# Altium project SoM.PrjPcb (part 3 of 4)

## Sheet [15] PushButtons.SchDoc
size B; Organization: Altium Limited; Address1: L3, 12a Rodborough Rd; Address2: Frenchs Forest; Address3: NSW; Address4: Australia 2086
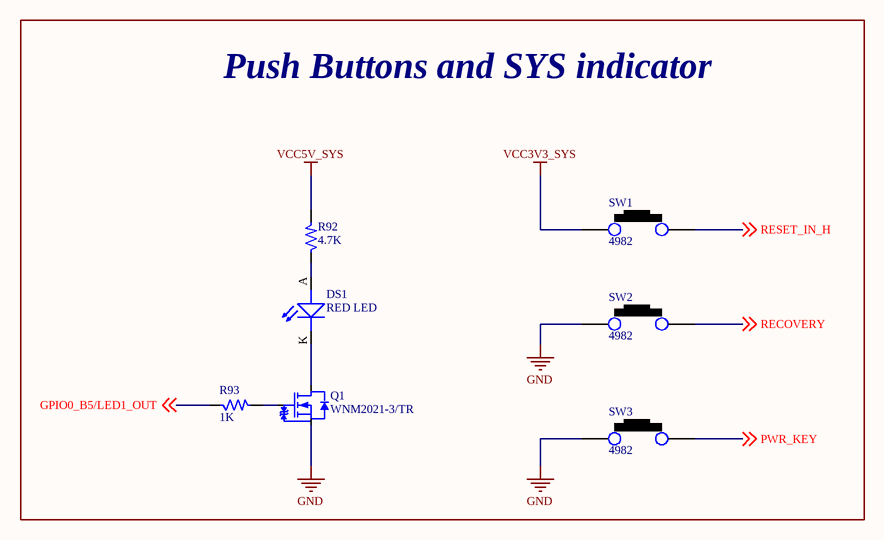
[diagram p14: [15] PushButtons.SchDoc]

### Parts
DS1  RED LED  [LED_0805]
Q1  WNM2021-3/TR  [SOT-323-3]
R92  4.7K  [RES_0201]
R93  1K  [RES_0201]
SW1  4982  [SW_177_39.3X77.7_SMD]
SW2  4982  [SW_177_39.3X77.7_SMD]
SW3  4982  [SW_177_39.3X77.7_SMD]

### Blocks framed on the sheet
Push Buttons and SYS indicator: DS1 Q1 R92 R93 SW1-SW3

### Nets
GND: Q1.2(S) SW2.1 SW3.1
VCC3V3_SYS: SW1.1  [project net VCC7]
VCC5V_SYS: R92.2
GPIO0_B5/LED1_OUT: R93.1 ; off-sheet GPIO0_B5/LED1_OUT
PWR_KEY: SW3.2 ; off-sheet PWR_KEY
RECOVERY: SW2.2 ; off-sheet RECOVERY
RESET_IN_H: SW1.2 ; off-sheet RESET_IN_H
NetDS1_A: DS1.A(ANODE) R92.1
NetDS1_K: DS1.K(CATHODE) Q1.3(D)
NetQ1_1: Q1.1(G) R93.2

### Notes on the sheet
- Title
- Size:
- Date:
- B
- Number:
- Time:
- Revision:
- Sheet
- of
- File:

### Library data of the parts
DS1 = LED_RED-2V-20mA-0805: Red 631nm LED Indication - Discrete 2V 0805 (2012 Metric); Manufacturer: Vishay Lite-On; Manufacturer Part Number: LTST-C171KRKT; Case/Package: 0805; Supplier-1: SP ROAD
Q1 = MOSFET-N_20V-820mA-SOT-323: N Channel 20V 820mA 850mV @ 250uA 310mΩ @ 550mA,4.5V 310mW SOT-323(SC-70) MOSFET RoHS /; Manufacturer: WILLSEMI(Will Semicon); Manufacturer Part Number: WNM2021-3/TR; Case/Package: SOT-323(SC-70); Supplier-1: LCSC
R92 = RES_4.7K-0.1W-1%-0201: 4.02 kOhms ±1% 0.05W, 1/20W Chip Resistor 0201 (0603 Metric) Thick Film /; Manufacturer: Yageo; Manufacturer Part Number: RC0201FR-074K02L; Case/Package: 0201; Supplier-1: Digikey
R93 = RES_1K-0.05W-1%-0201: 1 kOhms ±1% 0.05W, 1/20W Chip Resistor 0201 (0603 Metric) Thick Film /; Manufacturer: Yageo; Manufacturer Part Number: RC0201FR-071KL; Case/Package: 0201; Supplier-1: Digikey
SW1-SW3 = SW1_4982: Tactile Switch 3x4x2mm SMD 2-Pin; Manufacturer: NA; Manufacturer Part Number: NA; Case/Package: SMD; Supplier-1: Sunrom

## Sheet [16] SPI_TYPEC_PWR.SchDoc
size B; Organization: Altium Limited; Address1: L3, 12a Rodborough Rd; Address2: Frenchs Forest; Address3: NSW; Address4: Australia 2086
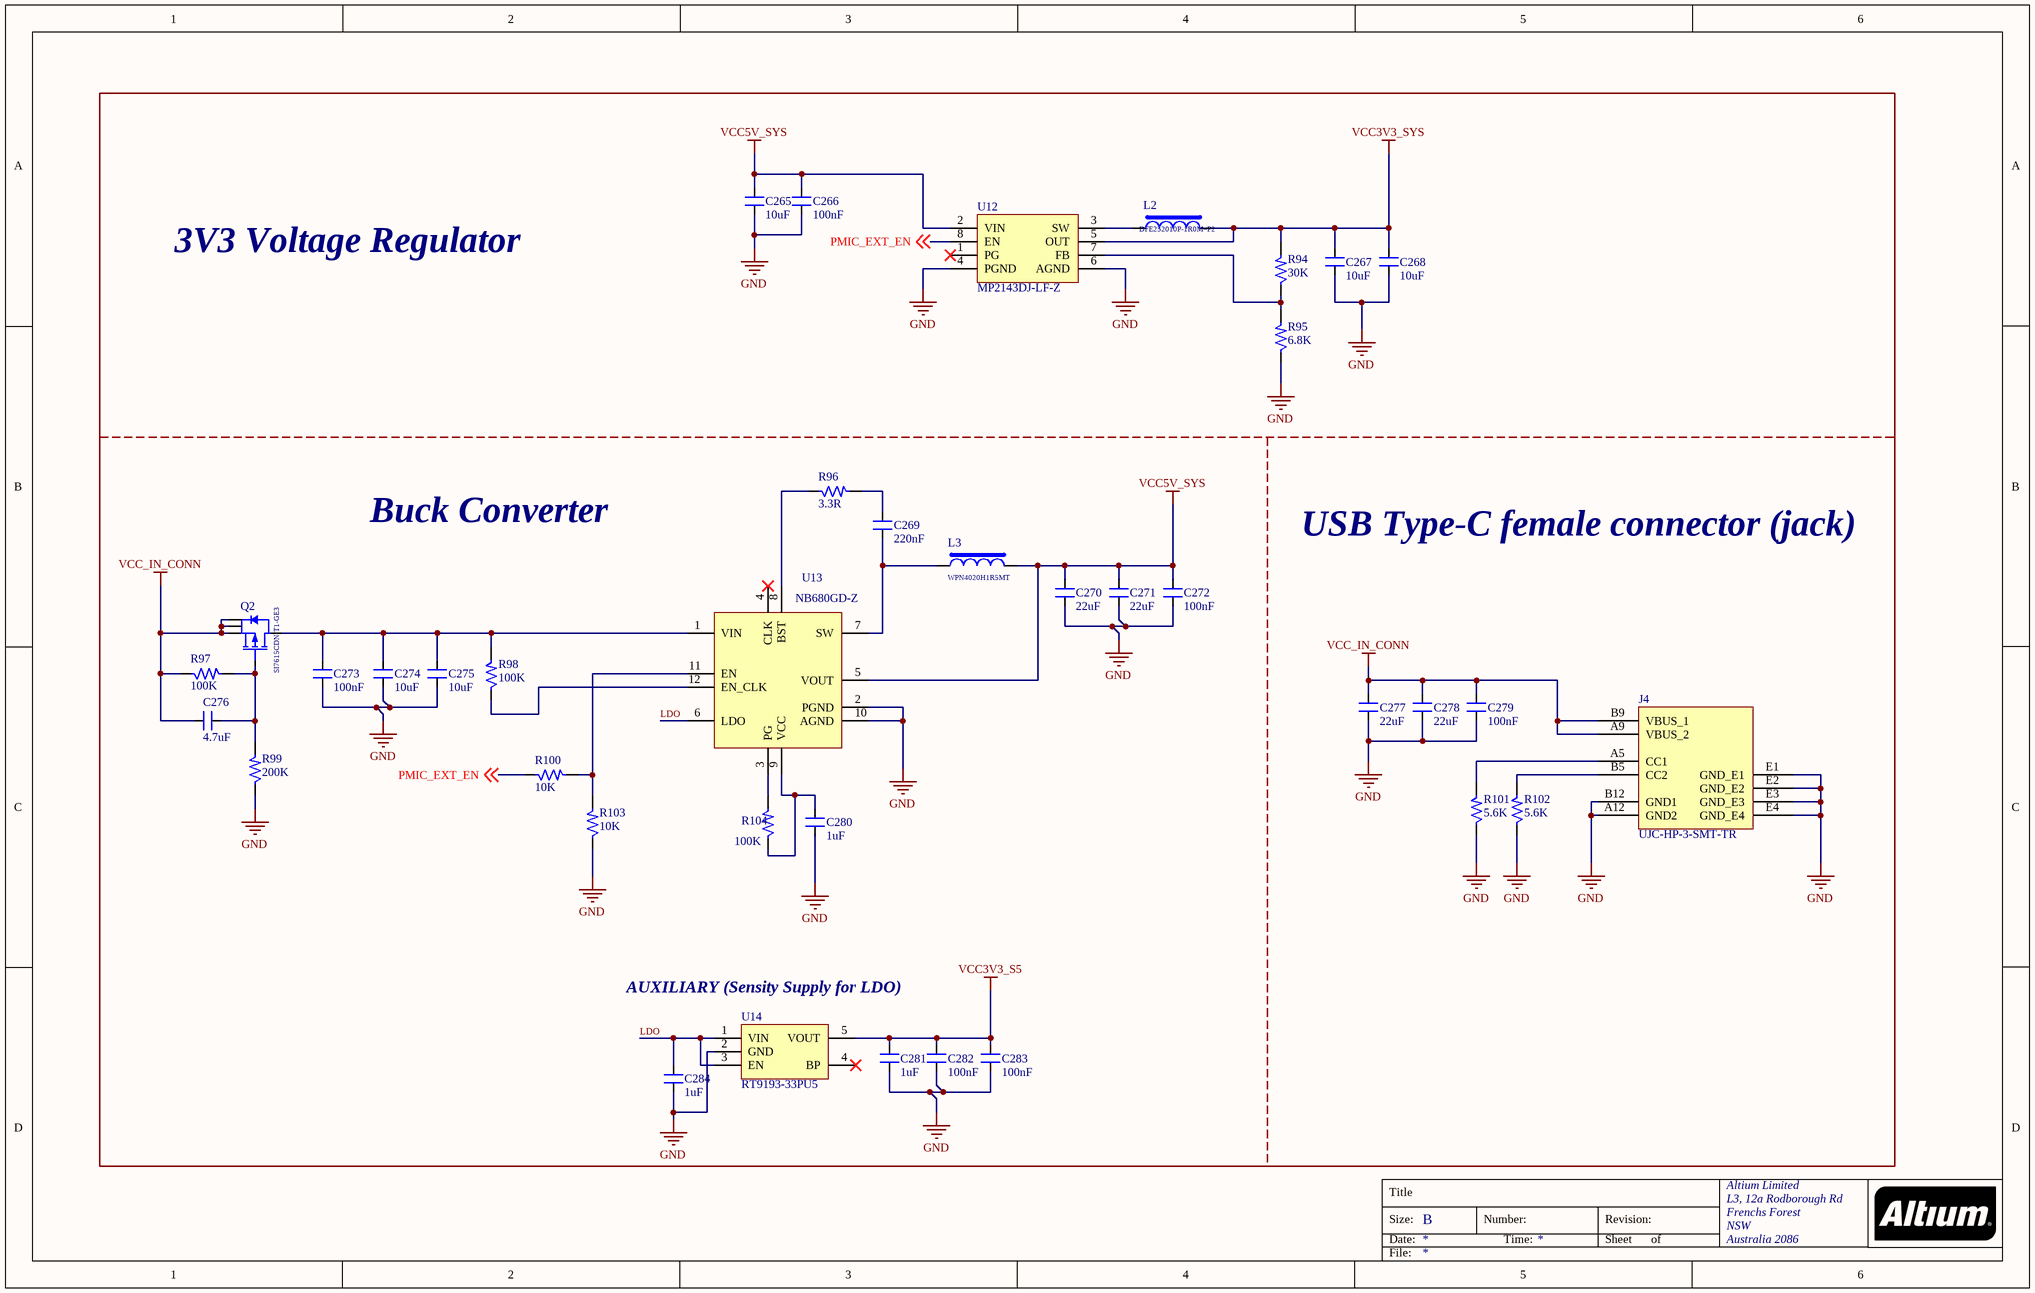
[diagram p15: [16] SPI_TYPEC_PWR.SchDoc]

### Parts
C265  10uF  [CAP_0402]
C266  100nF  [CAP_0402]
C267  10uF  [CAP_0402]
C268  10uF  [CAP_0402]
C269  220nF  [CAP_0402]
C270  22uF  [CAP_0402]
C271  22uF  [CAP_0402]
C272  100nF  [CAP_0402]
C273  100nF  [CAP_0402]
C274  10uF  [CAP_0402]
C275  10uF  [CAP_0402]
C276  4.7uF  [CAP_0402]
C277  22uF  [CAP_0402]
C278  22uF  [CAP_0402]
C279  100nF  [CAP_0201]
C280  1uF  [CAP_0402]
C281  1uF  [CAP_0402]
C282  100nF  [CAP_0402]
C283  100nF  [CAP_0402]
C284  1uF  [CAP_0402]
J4  UJC-HP-3-SMT-TR  [CON6_48.4_UJC-HP-3-SMT-TR]
L2  DFE252010P-1R0M=P2  [IND_1008]
L3  WPN4020H1R5MT  [IND_1616]
Q2  SI7615CDN-T1-GE3  [PowerPAK_1212-8_SMD]
R94  30K  [RES_0402]
R95  6.8K  [RES_0402]
R96  3.3R  [RES_0402]
R97  100K  [RES_0402]
R98  100K  [RES_0402]
R99  200K  [RES_0402]
R100  10K  [RES_0402]
R101  5.6K  [RES_0201]
R102  5.6K  [RES_0201]
R103  10K  [RES_0402]
R104  100K  [RES_0402]
U12  MP2143DJ-LF-Z  [SOT23-8]
U13  NB680GD-Z  [QFN-12_19_118X118_SMD]
U14  RT9193-33PU5  [SC70-5]

### Nets
GND: C265.1 C266.1 C267.1 C268.1 C270.1 C271.1 C272.1 C273.1 C274.1 C275.1 C277.1 C278.1 C279.1 C280.1 C281.1 C282.1 C283.1 C284.1 J4.A12(GND2) J4.B12(GND1) J4.E1(GND_E1) J4.E2(GND_E2) J4.E3(GND_E3) J4.E4(GND_E4) R95.1 R99.1 R101.1 R102.1 R103.1 U12.4(PGND) U12.6(AGND) U13.2(PGND) U13.10(AGND) U14.2(GND)
VCC3V3_S5: C281.2 C282.2 C283.2 U14.5(VOUT)
VCC3V3_SYS: C267.2 C268.2 L2.2 R94.2 U12.5(OUT)  [project net VCC7]
VCC5V_SYS: C265.2 C266.2 C270.2 C271.2 C272.2 L3.2 U12.2(VIN) U13.5(VOUT)
VCC_IN_CONN: C276.1 C277.2 C278.2 C279.2 J4.A9(VBUS_2) J4.B9(VBUS_1) Q2.1(S) Q2.2(S) Q2.3(S) R97.1
LDO: C284.2 U13.6(LDO) U14.1(VIN) U14.3(EN)
PMIC_EXT_EN: R100.1 U12.8(EN) ; off-sheet PMIC_EXT_EN
NetC269_1: C269.1 L3.1 U13.7(SW)
NetC269_2: C269.2 R96.2
NetC273_2: C273.2 C274.2 C275.2 Q2.5(D) R98.2 U13.1(VIN)
NetC276_2: C276.2 Q2.4(G) R97.2 R99.2
NetC280_2: C280.2 R104.1 U13.9(VCC)
NetJ4_A5: J4.A5(CC1) R101.2
NetJ4_B5: J4.B5(CC2) R102.2
NetL2_1: L2.1 U12.3(SW)
NetR94_1: R94.1 R95.2 U12.7(FB)
NetR96_1: R96.1 U13.8(BST)
NetR98_1: R98.1 U13.12(EN_CLK)
NetR100_2: R100.2 R103.2 U13.11(EN)
NetR104_2: R104.2 U13.3(PG)

Not connected (* = marked no-connect by the designer): U12 1(PG)*; U13 4(CLK)*; U14 4(BP)*

### Notes on the sheet
- 3V3 Voltage Regulator
- Buck Converter
- USB Type-C female connector (jack)
- AUXILIARY (Sensity Supply for LDO)
- Title
- Size:
- Date:
- B
- Number:
- Time:
- Revision:
- Sheet
- of
- File:

### Library data of the parts
C265 C267 C268 C274 C275 = CAP_10uF-10V-20%-0402: as C243 on sheet [13] TYPEC0_PROG; Case/Package: 0402; Supplier-1: Digikey
C266 = CAP_100nF-10V-10%-0402: 0.1µF ±10% 10V Ceramic Capacitor X7R 0402 (1005 Metric) /; Manufacturer: Yageo; Manufacturer Part Number: CC0402KRX7R6BB104; Case/Package: 0402; Supplier-1: Digikey
C269 = CAP_220nF-10V-10%-0402: 0.22µF ±10% 10V Ceramic Capacitor X7R 0402 (1005 Metric) /; Manufacturer: Samsung Electro-Mechanics; Manufacturer Part Number: CL05B224KP5NNNC; Case/Package: 0402; Supplier-1: Digikey
C270 C271 C277 C278 = CAP_22uF-6.3V-20%-0402: 22µF ±20% 6.3V Ceramic Capacitor X5R 0402 (1005 Metric) /; Manufacturer: Murata Electronics; Manufacturer Part Number: CL05A226MQ5N6J8; Case/Package: 0402; Supplier-1: Digikey
C272 C273 C282 C283 = CAP_100nF-25V-10%-0402: as C231 on sheet [13] TYPEC0_PROG; Case/Package: 0402; Supplier-1: Digikey
C276 = CAP_4.7uF-10V-10%-0402: 4.7µF ±10% 10V Ceramic Capacitor X5R 0402 (1005 Metric) /; Manufacturer: Samsung Electro-Mechanics; Manufacturer Part Number: CL05A475KP5NRNC; Case/Package: 0402; Supplier-1: Digikey
C279 = CAP_100nF-25V-10%-0201: as C187-C190 on sheet [4] RK3399_EMMC_ADC_PCIE; Case/Package: 0201; Supplier-1: Digikey
C280 = CAP_1uF-16V-10%-0402: as C252 on sheet [14] Ethernet; Case/Package: 0402; Supplier-1: Digikey
C281 C284 = CAP_1uF-10V-10%-0402: as C232-C234 on sheet [13] TYPEC0_PROG; Case/Package: 0402; Supplier-1: Digikey
J4 = CON-TYPEC_6X1-100-RA-TH: USB Connectors USB jack, C type, power only, 6 pin, horizonal, gold flash plating, surface mount, T&R; Manufacturer: CUI Devices; Manufacturer Part Number: UJC-HP-3-SMT-TR; Case/Package: TH; Supplier-1: Mouser
L2 = IND_1uH-3.8A-20%-1008: 1µH Shielded Wirewound Inductor 3.8A 54mOhm Max 1008 (2520 Metric) /; Manufacturer: Murata Electronics; Manufacturer Part Number: DFE252010P-1R0M=P2; Case/Package: 1008; Supplier-1: Digikey
L3 = IND_1.5uH-6A-20%-SMD: Wire Wound SMD Power Inductors – WPN Series / Operating Temp. : -40℃~+125℃ (Including self-heating) /; Manufacturer: Sunlord; Mnaufcaturer Part Number: WPN4020H1R5MT; Case/Package: SMD; Supplier-1: NA
Q2 = MOSFET-P_20V-35A-1212-8: P-Channel 20V 35A (Tc) 33W (Tc) Surface Mount PowerPAK® 1212-8 /; Manufacturer: Vishay Siliconix; Manufacturer Part Number: SI7615CDN-T1-GE3; Case/Package: PowerPAK® 1212-8; Supplier-1: Digikey
R94 = RES_30K-0.1W-1%-0402: 30 kOhms ±1% 0.1W, 1/10W Chip Resistor 0402 (1005 Metric) Automotive AEC-Q200, Moisture Resistant Thick Film /; Manufacturer: KOA Speer Electronics, Inc.; Manufacturer Part Number: RK73H1ETTP3002F; Case/Package: 0402; Supplier-1: Digikey
R95 = RES_6.8K-0.1W-1%-0402: 6.8 kOhms ±1% 0.1W, 1/10W Chip Resistor 0402 (1005 Metric) Anti-Sulfur Thin Film /; Manufacturer: Vishay Beyschlag/Draloric/BC Components; Manufacturer Part Number: MCS04020C6801FE000; Supplier-1: Digikey; Case/Package: 0402
R96 = RES_3.3R-0.1W-1%-0402: 3.3 Ohms ±1% 0.1W, 1/10W Chip Resistor 0402 (1005 Metric) Anti-Sulfur, Automotive AEC-Q200 Thick Film /; Manufacturer: Panasonic Electronic Components; Manufacturer Part Number: ERJ-U02F3R30X; Case/Package: 0402; Supplier-1: Digikey
R97 R98 R104 = RES_100K-0.1W-1%-0402: 100 kOhms ±1% 0.1W, 1/10W Chip Resistor 0402 (1005 Metric) Anti-Sulfur Thin Film /; Manufacturer: Vishay Beyschlag/Draloric/BC Components; Manufacturer Part Number: MCS04020C1003FE000; Case/Package: 0402; Supplier-1: Digikey
R99 = RES_200K-0.1W-1%-0402: 200 kOhms ±1% 0.1W, 1/10W Chip Resistor 0402 (1005 Metric) Automotive AEC-Q200 Thick Film /; Manufacturer: Panasonic Electronic Components; Manufacturer Part number: ERJ-2RKF2003X; Case/Package: 0402; Supplier-1: Digikey
R100 R103 = RES_10K-0.1W-1%-0402: 10 kOhms ±1% 0.1W, 1/10W Chip Resistor 0402 (1005 Metric) Anti-Sulfur Thin Film /; Manufacturer: Vishay Beyschlag/Draloric/BC Components; Manufacturer Part Number: MCS04020C1002FE000; Case/Package: 0402; Supplier-1: Digikey
R101 R102 = RES_5.6K-0.05W-1%-0201: 5.6 kOhms ±1% 0.05W, 1/20W Chip Resistor 0201 (0603 Metric) Automotive AEC-Q200 Thick Film /; Manufacturer: Panasonic Electronic Components; Manufacturer Part Number: ERJ-1GNF5601C; Case/Package: 0201; Supplier-1: Digikey
U12 = REG_0.6~5V-5.5V-3A-TSOT-23-8: Switching Voltage Regulators 3A, 5.5V, 1.2MHz Sync Stp-Dwn Swtchr; Manufacturer: Monolithic Power Systems (MPS); Manufacturer Part Number: MP2143DJ-LF-Z; Case/Package: TSOT-23-8; Supplier-1: Mouser
U13 = REG_3.3V-26V-8A-QFN-12: Switching Voltage Regulators 26V Fixed 3.3 V-8A Sync Buck Converter; Manufacturer: Monolithic Power Systems (MPS); Manufacturer Part Number: NB680GD-Z; Case/Package: QFN-12; Supplier-1: Mouser
U14 = REG_3.3V-5.5V-300mA-SC-70-5: SC-70-5 Dropout Regulators(LDO) RoHS; Manufacturer: Richtek Tech; Manufacturer Part Number: RT9193-33PU5; Case/Package: SC-70-5; Supplier-1: LCSC

## Sheet [17] Voltage_Regulators.SchDoc
size B; Organization: Altium Limited; Address1: L3, 12a Rodborough Rd; Address2: Frenchs Forest; Address3: NSW; Address4: Australia 2086
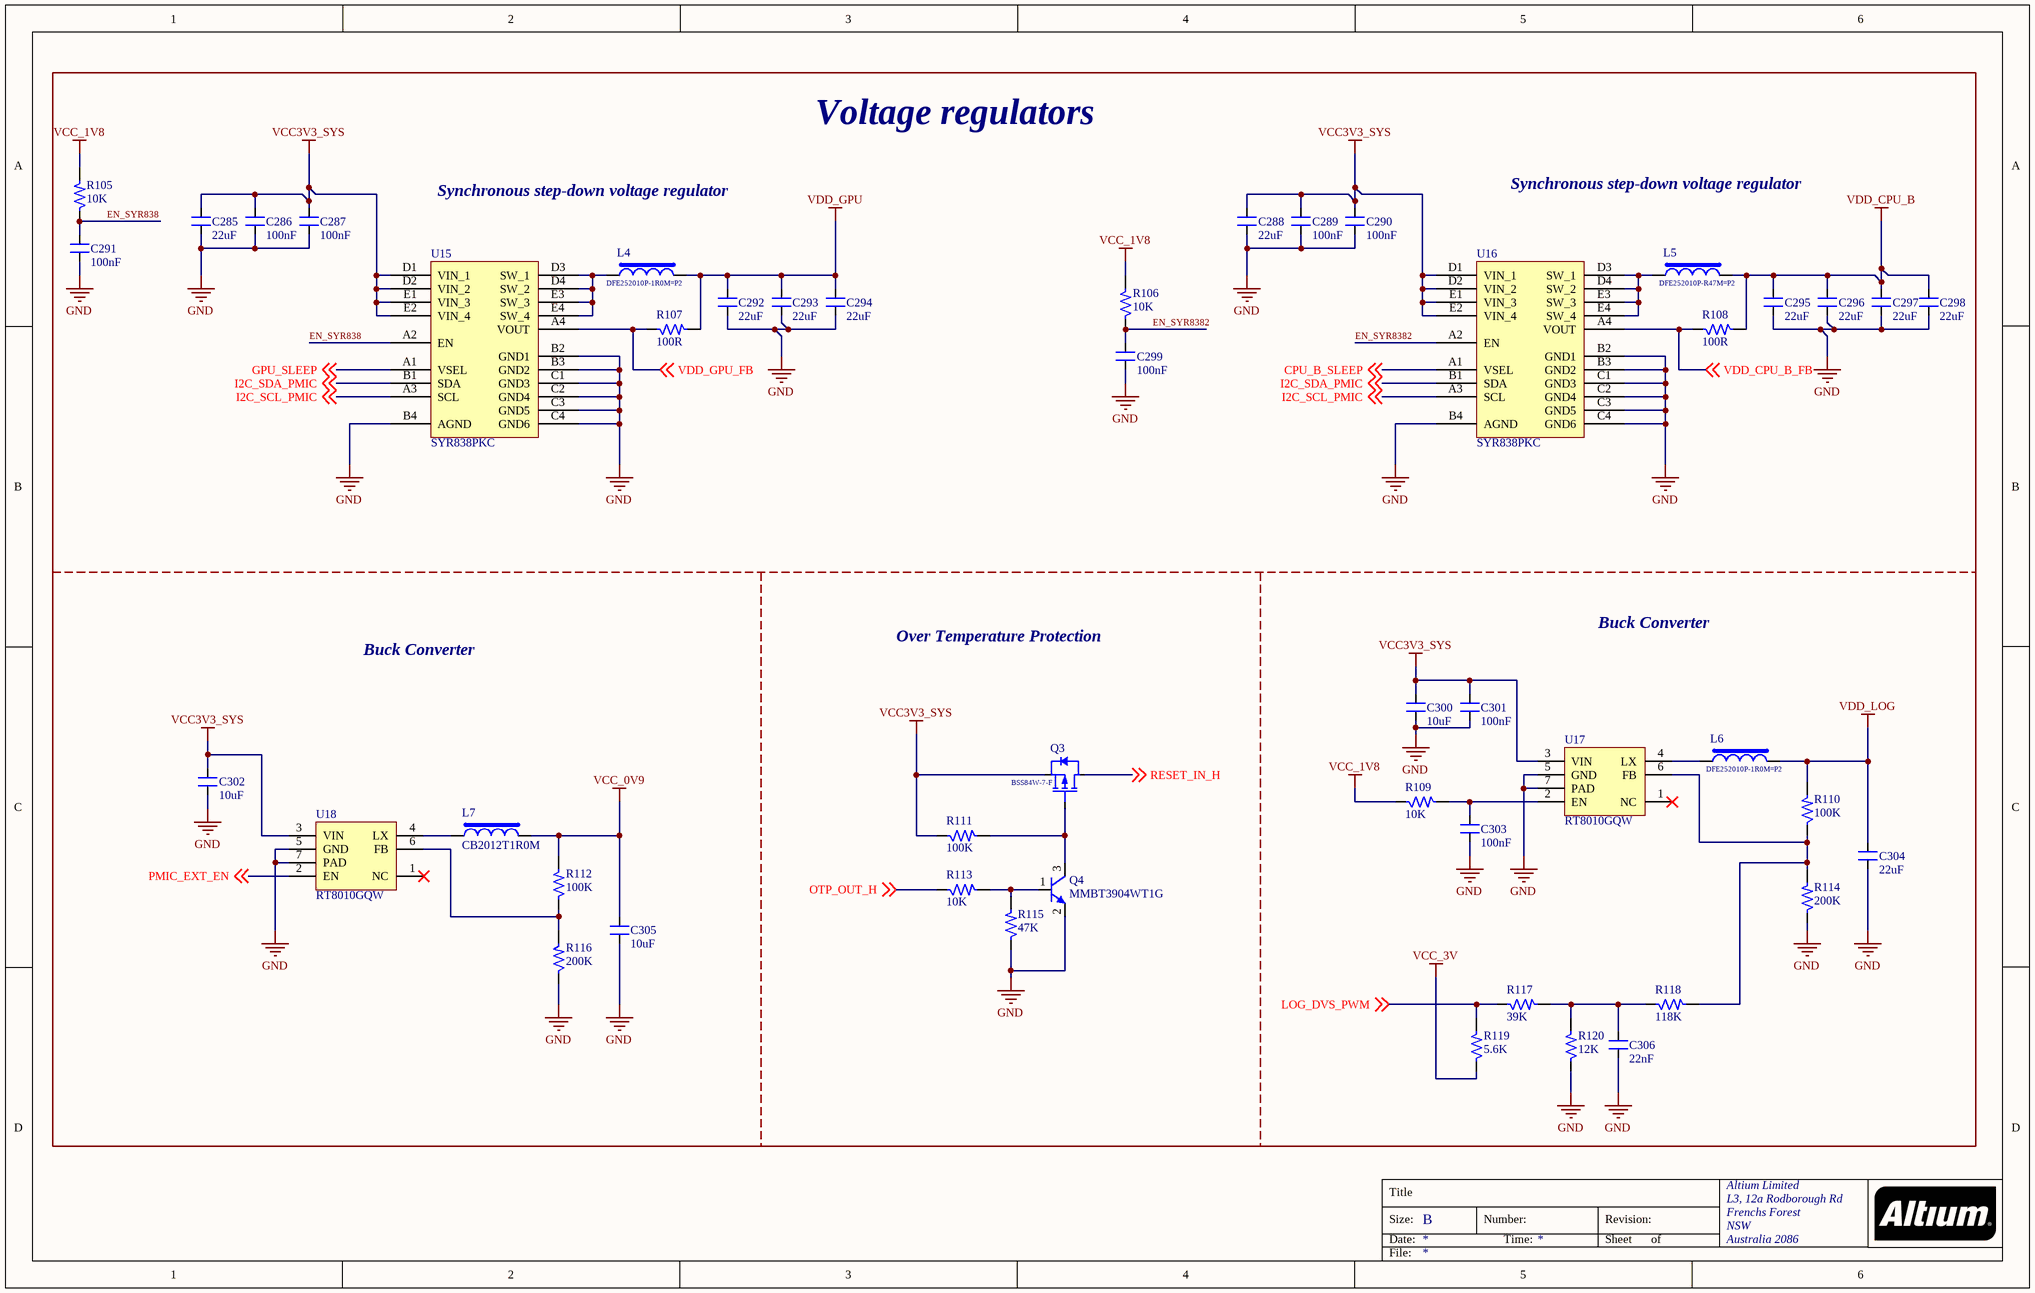
[diagram p16: [17] Voltage_Regulators.SchDoc]

### Parts
C285  22uF  [CAP_0402]
C286  100nF  [CAP_0402]
C287  100nF  [CAP_0402]
C288  22uF  [CAP_0402]
C289  100nF  [CAP_0402]
C290  100nF  [CAP_0402]
C291  100nF  [CAP_0402]
C292  22uF  [CAP_0402]
C293  22uF  [CAP_0402]
C294  22uF  [CAP_0402]
C295  22uF  [CAP_0402]
C296  22uF  [CAP_0402]
C297  22uF  [CAP_0402]
C298  22uF  [CAP_0402]
C299  100nF  [CAP_0402]
C300  10uF  [CAP_0402]
C301  100nF  [CAP_0402]
C302  10uF  [CAP_0402]
C303  100nF  [CAP_0402]
C304  22uF  [CAP_0402]
C305  10uF  [CAP_0402]
C306  22nF  [CAP_0402]
L4  DFE252010P-1R0M=P2  [IND_1008]
L5  DFE252010P-R47M=P2  [IND_1008]
L6  DFE252010P-1R0M=P2  [IND_1008]
L7  CB2012T1R0M  [IND_0805]
Q3  BSS84W-7-F  [SOT-323-3]
Q4  MMBT3904WT1G  [SOT-323-3]
R105  10K  [RES_0402]
R106  10K  [RES_0402]
R107  100R  [RES_0402]
R108  100R  [RES_0402]
R109  10K  [RES_0402]
R110  100K  [RES_0402]
R111  100K  [RES_0402]
R112  100K  [RES_0402]
R113  10K  [RES_0402]
R114  200K  [RES_0402]
R115  47K  [RES_0402]
R116  200K  [RES_0402]
R117  39K  [RES_0402]
R118  118K  [RES_0402]
R119  5.6K  [RES_0402]
R120  12K  [RES_0402]
U15  SYR838PKC  [CSP20_15.7_100x84_SMD]
U16  SYR838PKC  [CSP20_15.7_100x84_SMD]
U17  RT8010GQW  [WDFN-6_26_133X100_SMD]
U18  RT8010GQW  [WDFN-6_26_133X100_SMD]

### Nets
GND: C285.1 C286.1 C287.1 C288.1 C289.1 C290.1 C291.1 C292.1 C293.1 C294.1 C295.1 C296.1 C297.1 C298.1 C299.1 C300.1 C301.1 C302.1 C303.1 C304.1 C305.1 C306.1 Q4.2(E) R114.1 R115.1 R116.1 R120.1 U15.B2(GND1) U15.B3(GND2) U15.B4(AGND) U15.C1(GND3) U15.C2(GND4) U15.C3(GND5) U15.C4(GND6) U16.B2(GND1) U16.B3(GND2) U16.B4(AGND) U16.C1(GND3) U16.C2(GND4) U16.C3(GND5) U16.C4(GND6) U17.5(GND) U17.7(PAD) U18.5(GND) U18.7(PAD)
VCC3V3_SYS: C285.2 C286.2 C287.2 C288.2 C289.2 C290.2 C300.2 C301.2 C302.2 Q3.2(S) R111.1 U15.D1(VIN_1) U15.D2(VIN_2) U15.E1(VIN_3) U15.E2(VIN_4) U16.D1(VIN_1) U16.D2(VIN_2) U16.E1(VIN_3) U16.E2(VIN_4) U17.3(VIN) U18.3(VIN)  [project net VCC7]
VCC_0V9: C305.2 L7.2 R112.2  [project net EDP_AVDD_0V9]
VCC_1V8: R105.2 R106.2 R109.1  [project net EDP_AVDD_1V8]
VCC_3V: R119.1  [project net VLDO8]
VDD_CPU_B: C295.2 C296.2 C297.2 C298.2 L5.2 R108.2
VDD_GPU: C292.2 C293.2 C294.2 L4.2 R107.2
VDD_LOG: C304.2 L6.2 R110.2
CPU_B_SLEEP: U16.A1(VSEL) ; off-sheet CPU_B_SLEEP
EN_SYR838: C291.2 R105.1 U15.A2(EN)
EN_SYR8382: C299.2 R106.1 U16.A2(EN)
GPU_SLEEP: U15.A1(VSEL) ; off-sheet GPU_SLEEP
I2C_SCL_PMIC: U15.A3(SCL) U16.A3(SCL) ; off-sheet I2C_SCL_PMIC
I2C_SDA_PMIC: U15.B1(SDA) U16.B1(SDA) ; off-sheet I2C_SDA_PMIC
LOG_DVS_PWM: R117.1 R119.2 ; off-sheet LOG_DVS_PWM
OTP_OUT_H: R113.1 ; off-sheet OTP_OUT_H
PMIC_EXT_EN: U18.2(EN) ; off-sheet PMIC_EXT_EN
RESET_IN_H: Q3.3(D) ; off-sheet RESET_IN_H
VDD_CPU_B_FB: R108.1 U16.A4(VOUT) ; off-sheet VDD_CPU_B_FB
VDD_GPU_FB: R107.1 U15.A4(VOUT) ; off-sheet VDD_GPU_FB
NetC303_2: C303.2 R109.2 U17.2(EN)
NetC306_2: C306.2 R117.2 R118.1 R120.2
NetL4_1: L4.1 U15.D3(SW_1) U15.D4(SW_2) U15.E3(SW_3) U15.E4(SW_4)
NetL5_1: L5.1 U16.D3(SW_1) U16.D4(SW_2) U16.E3(SW_3) U16.E4(SW_4)
NetL6_1: L6.1 U17.4(LX)
NetL7_1: L7.1 U18.4(LX)
NetQ3_1: Q3.1(G) Q4.3(C) R111.2
NetQ4_1: Q4.1(B) R113.2 R115.2
NetR110_1: R110.1 R114.2 R118.2 U17.6(FB)
NetR112_1: R112.1 R116.2 U18.6(FB)

Not connected (* = marked no-connect by the designer): U17 1(NC)*; U18 1(NC)*

### Notes on the sheet
- Voltage regulators
- Synchronous step-down voltage regulator
- Over Temperature Protection
- Buck Converter
- Title
- Size:
- Date:
- B
- Number:
- Time:
- Revision:
- Sheet
- of
- File:

### Library data of the parts
C285 C288 C292-C298 C304 = CAP_22uF-6.3V-20%-0402: 22µF ±20% 6.3V Ceramic Capacitor X5R 0402 (1005 Metric) /; Manufacturer: Murata Electronics; Manufacturer Part Number: CL05A226MQ5N6J8; Case/Package: 0402; Supplier-1: Digikey
C286 C287 C289-C291 C299 = CAP_100nF-25V-10%-0402: 0.1µF ±10% 25V Ceramic Capacitor X7R 0402 (1005 Metric) /; Manufacturer: Walsin Technology Corporation; Manufacturer Part Number: 0402B104K250CT; Case/Package: 0402; Supplier-1: Digikey
C300 C302 C305 = CAP_10uF-10V-20%-0402: 10µF ±20% 10V Ceramic Capacitor X5R 0402 (1005 Metric) /; Manufacturer Part Number: CL05A106MP5NUNC; Manufacturer: Samsung Electro-Mechanics; Case/Package: 0402; Supplier-1: Digikey
C301 C303 = CAP_100nF-10V-10%-0402: 0.1µF ±10% 10V Ceramic Capacitor X7R 0402 (1005 Metric) /; Manufacturer: Yageo; Manufacturer Part Number: CC0402KRX7R6BB104; Case/Package: 0402; Supplier-1: Digikey
C306 = CAP_22nF-10V-10%-0402: 0.022µF ±10% 10V Ceramic Capacitor X7R 0402 (1005 Metric) /; Manufacturer: Samsung Electro-Mechanics; Manufacturer Part Number: CL05B223KP5NNNC; Case/Package: 0402; Supplier-1: Digikey
L4 L6 = IND_1uH-3.8A-20%-1008: 1µH Shielded Wirewound Inductor 3.8A 54mOhm Max 1008 (2520 Metric) /; Manufacturer: Murata Electronics; Manufacturer Part Number: DFE252010P-1R0M=P2; Case/Package: 1008; Supplier-1: Digikey
L5 = IND_470nH-5A-20%-1008: 470nH Shielded Wirewound Inductor 5A 35mOhm Max 1008 (2520 Metric); Manufacturer: Murata Electronics; Manufacturer Part Number: DFE252010P-R47M=P2; Case/Package: 1008; Supplier-1: Digikey
L7 = IND_1uF-0.5A-20%-0805: 1uH ±20% 500mA 150mΩ 0805 Inductors (SMD) RoHS /; Manufacturer: Taiyo Yuden; Manufacturer Part Number: CB2012T1R0M; Case/Package: 0805; Supplier-1: LCSC
Q3 = MOSFET-P_50V-130mA-SOT-323: P-Channel 50V 130mA (Ta) 200mW (Ta) Surface Mount SOT-323; Manufacturer: Diodes Incorporated; Manufacturer Part Number: BSS84W-7-F; Case/Package: SOT-323; Supplier-1: Digikey
Q4 = TRAN-NPN_40V-200mA-SOT323: Bipolar (BJT) Transistor NPN 40V 200mA 300MHz 150mW Surface Mount SC-70-3 (SOT323); Manufacturer: ON Semiconductor; Manufacturer Part Number: MMBT3904WT1G; Case/Package: SOT323; Supplier-1: Digikey
R105 R106 R109 R113 = RES_10K-0.1W-1%-0402: 10 kOhms ±1% 0.1W, 1/10W Chip Resistor 0402 (1005 Metric) Anti-Sulfur Thin Film /; Manufacturer: Vishay Beyschlag/Draloric/BC Components; Manufacturer Part Number: MCS04020C1002FE000; Case/Package: 0402; Supplier-1: Digikey
R107 R108 = RES_100R-0.1W-1%-0402: 100 Ohms ±1% 0.1W, 1/10W Chip Resistor 0402 (1005 Metric) Automotive AEC-Q200, Moisture Resistant Thick Film /; Manufacturer: KOA Speer Electronics, Inc.; Manufacturer Part Number: RK73H1ETTP1000F; Case/Package: 0402; Supplier-1: Digikey
R110-R112 = RES_100K-0.1W-1%-0402: 100 kOhms ±1% 0.1W, 1/10W Chip Resistor 0402 (1005 Metric) Anti-Sulfur Thin Film /; Manufacturer: Vishay Beyschlag/Draloric/BC Components; Manufacturer Part Number: MCS04020C1003FE000; Case/Package: 0402; Supplier-1: Digikey
R114 R116 = RES_200K-0.1W-1%-0402: 200 kOhms ±1% 0.1W, 1/10W Chip Resistor 0402 (1005 Metric) Automotive AEC-Q200 Thick Film /; Manufacturer: Panasonic Electronic Components; Manufacturer Part number: ERJ-2RKF2003X; Case/Package: 0402; Supplier-1: Digikey
R115 = RES_47K-0.1W-1%-0402: 47 kOhms ±1% 0.1W, 1/10W Chip Resistor 0402 (1005 Metric) Automotive AEC-Q200 Thick Film /; Manufacturer: Panasonic Electronic Components; Manufacturer Part Number: ERJ-2RKF4702X; Case/Package: 0402; Supplier-1: Digikey
R117 = RES_39K-0.1W-1%-0402: 39 kOhms ±1% 0.1W, 1/10W Chip Resistor 0402 (1005 Metric) Automotive AEC-Q200, Moisture Resistant Thick Film /; Manufacturer: KOA Speer Electronics, Inc.; Manufacturer Part Number: RK73H1ETTP3902F; Case/Package: 0402; Supplier-1: Digikey
R118 = RES_118K-0.1W-1%-0402: 118 kOhms ±1% 0.1W, 1/10W Chip Resistor 0402 (1005 Metric) Automotive AEC-Q200, Moisture Resistant Thick Film /; Manufacturer: KOA Speer Electronics, Inc.; Manuafcturer Part Number: RK73H1ETTP1183F; Case/Package: 0402; Supplier-1: Digikey
R119 = RES_5.6K-0.1W-1%-0402: 5.6 kOhms ±1% 0.1W, 1/10W Chip Resistor 0402 (1005 Metric) Automotive AEC-Q200, Moisture Resistant Thick Film /; Manufacturer: KOA Speer Electronics, Inc.; Manufacturer Part Number: RK73H1ETTP5601F; Case/Package: 0402; Supplier-1: Digikey
R120 = RES_12K-0.1W-1%-0402: 12 kOhms ±1% 0.1W, 1/10W Chip Resistor 0402 (1005 Metric) Anti-Sulfur Thin Film /; Manufacturer: Vishay Beyschlag/Draloric/BC Components; Manufacturer Part Number: MCS04020C1202FE000; Case/Package: 0402; Supplier-1: Digikey
U15 U16 = IC_SYR838PKC: Step-Down Positive Programmable 1 6A 2.4MHz CSP1.56*1.96-20 DC-DC Converters RoHS; Manufacturer: Silergy Corp; Manufacturer Part Number: SYR838PKC; Case/Package: CSP1.56*1.96-20; Supplier-1: LCSC
U17 U18 = REG-ADJ_5.5V-5.5V-1A-6-WDFN: Buck Switching Regulator IC Positive Adjustable 0.6V 1 Output 1A 6-WDFN Exposed Pad; Manufacturer: Richtek USA Inc.; Manufacturer Part Number: RT8010GQW; Case/Package: 6-WDFN; Supplier-1: Digikey

## Sheet [18] Power_Management.SchDoc
size B; Organization: Altium Limited; Address1: L3, 12a Rodborough Rd; Address2: Frenchs Forest; Address3: NSW; Address4: Australia 2086
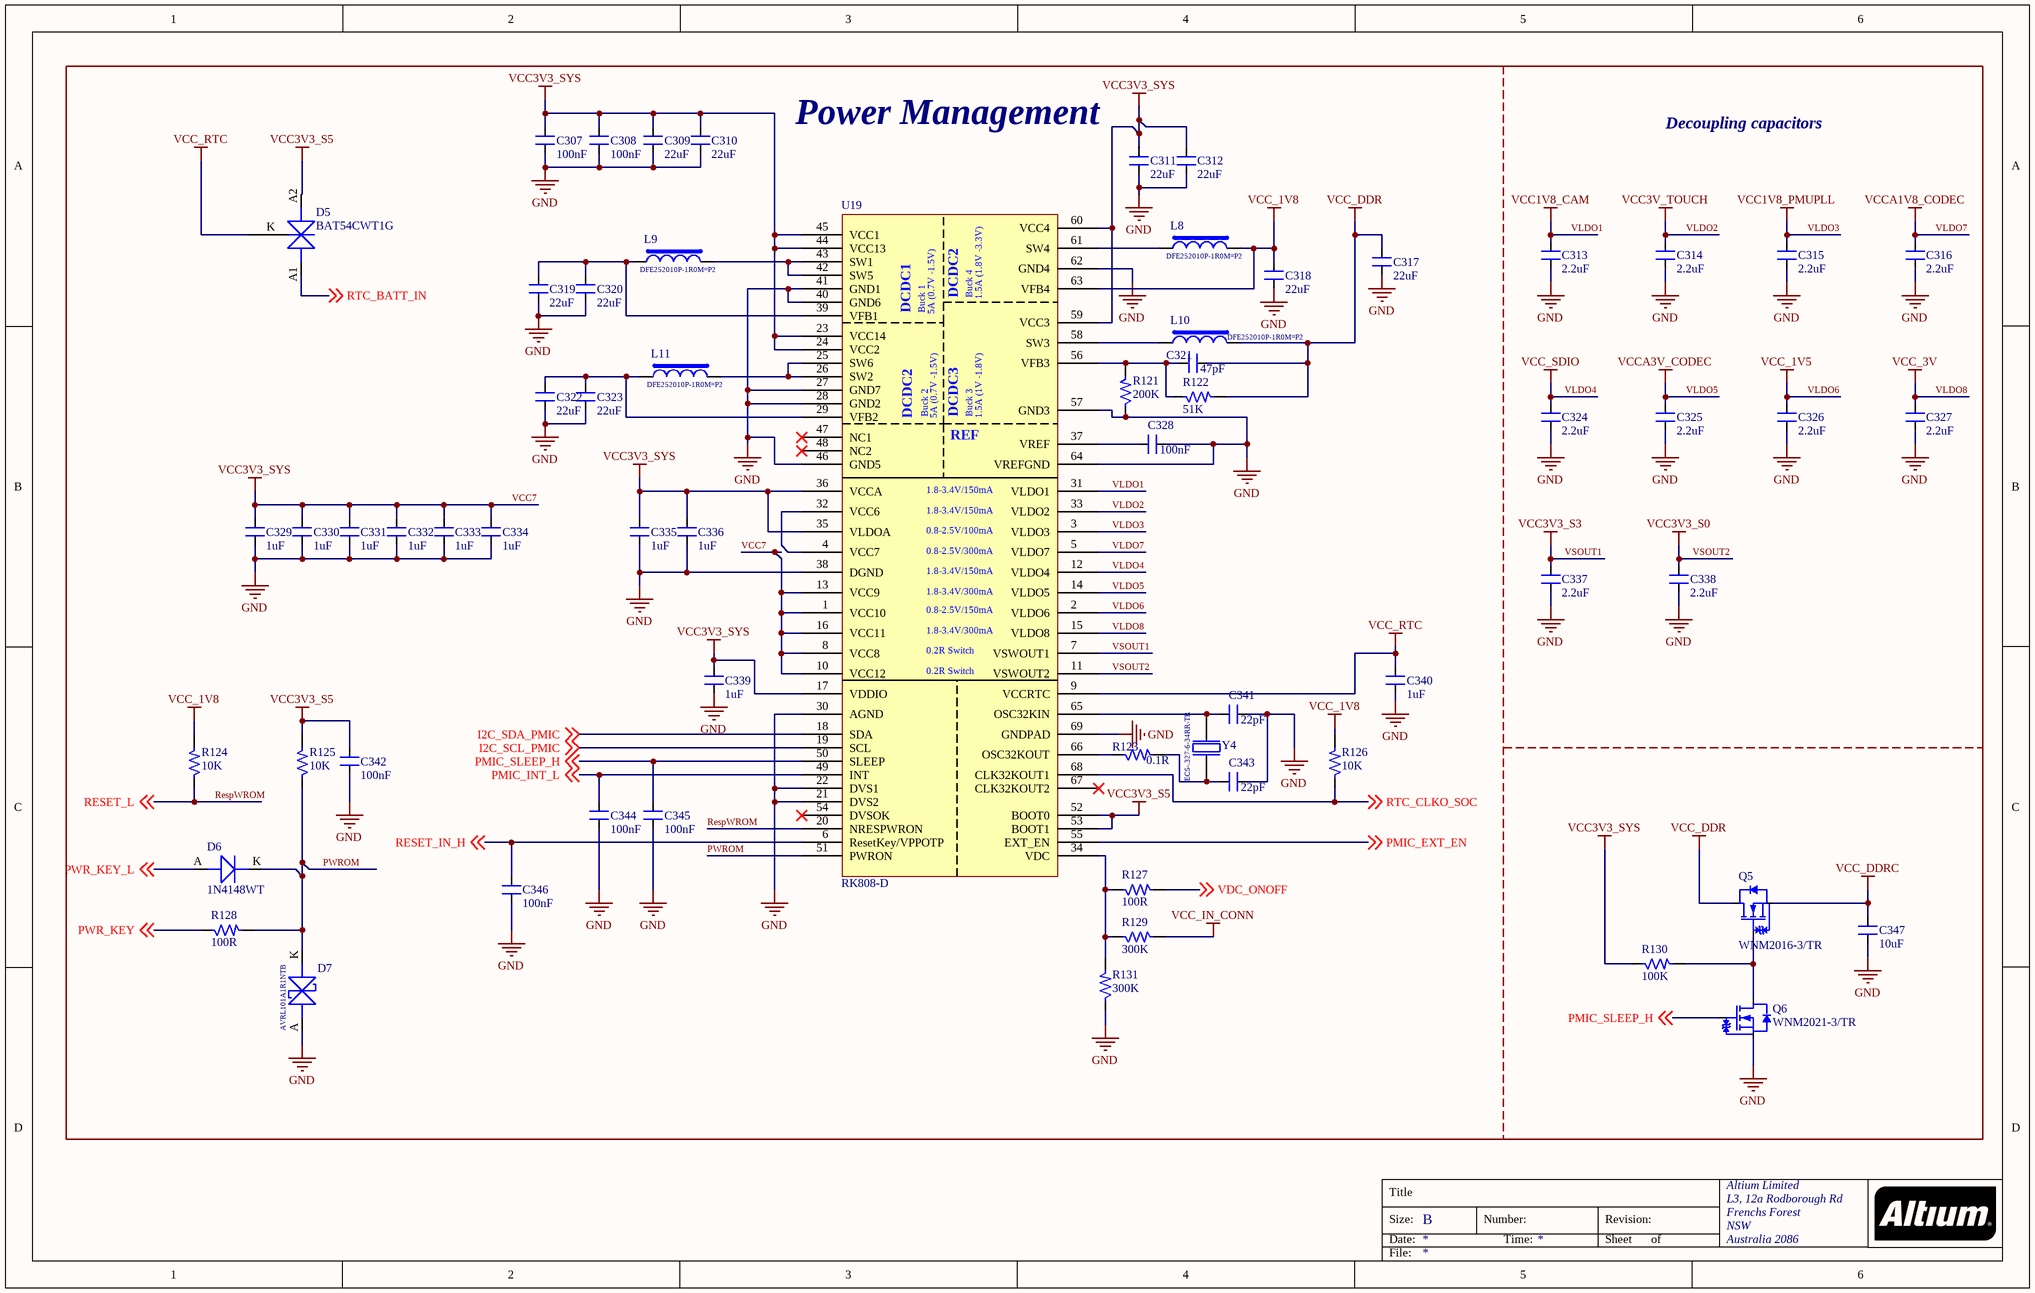
[diagram p17: [18] Power_Management.SchDoc]

### Parts
C307  100nF  [CAP_0402]
C308  100nF  [CAP_0402]
C309  22uF  [CAP_0603]
C310  22uF  [CAP_0603]
C311  22uF  [CAP_0603]
C312  22uF  [CAP_0603]
C313  2.2uF  [CAP_0402]
C314  2.2uF  [CAP_0402]
C315  2.2uF  [CAP_0402]
C316  2.2uF  [CAP_0402]
C317  22uF  [CAP_0603]
C318  22uF  [CAP_0603]
C319  22uF  [CAP_0603]
C320  22uF  [CAP_0603]
C321  47pF  [CAP_0402]
C322  22uF  [CAP_0603]
C323  22uF  [CAP_0603]
C324  2.2uF  [CAP_0402]
C325  2.2uF  [CAP_0402]
C326  2.2uF  [CAP_0402]
C327  2.2uF  [CAP_0402]
C328  100nF  [CAP_0402]
C329  1uF  [CAP_0402]
C330  1uF  [CAP_0402]
C331  1uF  [CAP_0402]
C332  1uF  [CAP_0402]
C333  1uF  [CAP_0402]
C334  1uF  [CAP_0402]
C335  1uF  [CAP_0402]
C336  1uF  [CAP_0402]
C337  2.2uF  [CAP_0402]
C338  2.2uF  [CAP_0402]
C339  1uF  [CAP_0402]
C340  1uF  [CAP_0402]
C341  22pF  [CAP_0402]
C342  100nF  [CAP_0402]
C343  22pF  [CAP_0402]
C344  100nF  [CAP_0402]
C345  100nF  [CAP_0402]
C346  100nF  [CAP_0402]
C347  10uF  [CAP_0402]
D5  BAT54CWT1G  [DIO_SOT-323-3]
D6  1N4148WT  [DIO_SOD523]
D7  AVRL101A1R1NTB  [DIO_0402_SMD]
L8  DFE252010P-1R0M=P2  [IND_1008]
L9  DFE252010P-1R0M=P2  [IND_1008]
L10  DFE252010P-1R0M=P2  [IND_1008]
L11  DFE252010P-1R0M=P2  [IND_1008]
Q5  WNM2016-3/TR  [SOT 23-3]
Q6  WNM2021-3/TR  [SOT-323-3]
R121  200K  [RES_0402]
R122  51K  [RES_0402]
R123  0.1R  [RES_0402]
R124  10K  [RES_0402]
R125  10K  [RES_0402]
R126  10K  [RES_0402]
R127  100R  [RES_0402]
R128  100R  [RES_0402]
R129  300K  [RES_0402]
R130  100K  [RES_0402]
R131  300K  [RES_0402]
U19  RK808-D  [QFN68_13.7_220.4X220.4_SMD]
Y4  ECS-.327-6-34RR-TR  [XTAL_ECS-.327-6-34RR-TR]

### Nets
GND: C307.1 C308.1 C309.1 C310.1 C311.1 C312.1 C313.1 C314.1 C315.1 C316.1 C317.1 C318.1 C319.1 C320.1 C322.1 C323.1 C324.1 C325.1 C326.1 C327.1 C328.2 C329.1 C330.1 C331.1 C332.1 C333.1 C334.1 C335.1 C336.1 C337.1 C338.1 C339.1 C340.1 C341.2 C342.1 C343.2 C344.1 C345.1 C346.1 C347.1 D7.A Q6.2(S) R121.1 R131.1 U19.21(DVS2) U19.22(DVS1) U19.27(GND7) U19.28(GND2) U19.30(AGND) U19.38(DGND) U19.40(GND6) U19.41(GND1) U19.46(GND5) U19.57(GND3) U19.62(GND4) U19.64(VREFGND) U19.69(GNDPAD)
VCC3V3_S5: C342.2 D5.A2 R125.2 U19.52(BOOT0) U19.53(BOOT1)
VCC7: C307.2 C308.2 C309.2 C310.2 C311.2 C312.2 C329.2 C330.2 C331.2 C332.2 C333.2 C334.2 C335.2 C336.2 C339.2 R130.1 U19.1(VCC10) U19.8(VCC8) U19.10(VCC12) U19.13(VCC9) U19.16(VCC11) U19.17(VDDIO) U19.23(VCC14) U19.24(VCC2) U19.35(VLDOA) U19.36(VCCA) U19.44(VCC13) U19.45(VCC1) U19.59(VCC3) U19.60(VCC4)  [also labelled VCC3V3_SYS]
VCC_1V8: C318.2 L8.2 R124.2 R126.2 U19.63(VFB4)  [project net EDP_AVDD_1V8]
VCC_DDR: C317.2 C321.2 L10.2 Q5.3(D) R122.2
VCC_DDRC: C347.2 Q5.2(S)
VCC_IN_CONN: R129.2
VCC_RTC: C340.2 D5.K U19.9(VCCRTC)
VLDO1: C313.2 U19.31(VLDO1)  [also labelled VCC1V8_CAM]
VLDO2: C314.2 U19.33(VLDO2)  [also labelled VCC3V_TOUCH]
VLDO3: C315.2 U19.3(VLDO3)  [also labelled VCC1V8_PMUPLL]
VLDO4: C324.2 U19.12(VLDO4)  [also labelled VCC_SDIO]
VLDO5: C325.2 U19.14(VLDO5)  [also labelled VCCA3V_CODEC]
VLDO6: C326.2 U19.2(VLDO6)  [also labelled VCC_1V5]
VLDO7: C316.2 U19.5(VLDO7)  [also labelled VCCA1V8_CODEC]
VLDO8: C327.2 U19.15(VLDO8)  [also labelled VCC_3V]
VSOUT1: C337.2 U19.7(VSWOUT1)  [also labelled VCC3V3_S3]
VSOUT2: C338.2 U19.11(VSWOUT2)  [also labelled VCC3V3_S0]
I2C_SCL_PMIC: U19.19(SCL) ; off-sheet I2C_SCL_PMIC
I2C_SDA_PMIC: U19.18(SDA) ; off-sheet I2C_SDA_PMIC
PMIC_EXT_EN: U19.55(EXT_EN) ; off-sheet PMIC_EXT_EN
PMIC_INT_L: C344.2 U19.49(INT) ; off-sheet PMIC_INT_L
PMIC_SLEEP_H: C345.2 Q6.1(G) U19.50(SLEEP) ; off-sheet PMIC_SLEEP_H
PWR_KEY: R128.1 ; off-sheet PWR_KEY
PWR_KEY_L: D6.A(ANODE) ; off-sheet PWR_KEY_L
PWROM: D6.K(CATHODE) D7.K R125.1 R128.2 U19.51(PWRON)
RESET_IN_H: C346.2 U19.6(ResetKey/VPPOTP) ; off-sheet RESET_IN_H
RespWROM: R124.1 U19.20(NRESPWRON) ; off-sheet RESET_L  [also labelled RESET_L]
RTC_BATT_IN: D5.A1 ; off-sheet RTC_BATT_IN
RTC_CLKO_SOC: R126.1 U19.68(CLK32KOUT1) ; off-sheet RTC_CLKO_SOC
VDC_ONOFF: R127.2 ; off-sheet VDC_ONOFF
NetC319_2: C319.2 C320.2 L9.1 U19.39(VFB1)
NetC321_1: C321.1 R121.2 R122.1 U19.56(VFB3)
NetC322_2: C322.2 C323.2 L11.1 U19.29(VFB2)
NetC328_1: C328.1 U19.37(VREF)
NetC341_1: C341.1 U19.65(OSC32KIN) Y4.2
NetC343_1: C343.1 R123.2 Y4.1
NetL8_1: L8.1 U19.61(SW4)
NetL9_2: L9.2 U19.42(SW5) U19.43(SW1)
NetL10_1: L10.1 U19.58(SW3)
NetL11_2: L11.2 U19.25(SW6) U19.26(SW2)
NetQ5_1: Q5.1(G) Q6.3(D) R130.2
NetR123_1: R123.1 U19.66(OSC32KOUT)
NetR127_1: R127.1 R129.1 R131.2 U19.34(VDC)
NetU19_4: U19.4(VCC7) U19.32(VCC6)

Not connected (* = marked no-connect by the designer): U19 47(NC1)* 48(NC2)* 54(DVSOK)* 67(CLK32KOUT2)*

### Notes on the sheet
- Power Management
- Decoupling capacitors
- Title
- Size:
- Date:
- B
- Number:
- Time:
- Revision:
- Sheet
- of
- File:
- (in symbol IC_RK808-D-QFN68) DCDC2; Buck 4; 1.5A (1.8V -3.3V); DCDC1; Buck 1; 5A (0.7V -1.5V); Buck 2; DCDC3; Buck 3; 1.5A (1V -1.8V); REF; 1.8-3.4V/150mA; 0.8-2.5V/100mA; 0.8-2.5V/300mA; 1.8-3.4V/300mA; 0.8-2.5V/150mA; 0.2R Switch

### Library data of the parts
C307 C308 = CAP_100nF-25V-10%-0402: as C286 on sheet [17] Voltage_Regulators; Case/Package: 0402; Supplier-1: Digikey
C309-C312 C317-C320 C322 C323 = CAP_22uF-10V-20%-0603: 22µF ±20% 10V Ceramic Capacitor X5R 0603 (1608 Metric) /; Manufacturer: Murata Electronics; Manufacturer Part Number: GRM188R61A226ME15D; Case/Package: 0603; Supplier-1: Digikey
C313-C316 C324-C327 C337 C338 = CAP_2.2uF-10V-10%-0402: 2.2µF ±10% 10V Ceramic Capacitor X5R 0402 (1005 Metric) /; Manufacturer: Murata Electronics; Manufacturer Part Number: GRM155R61A225KE95D; Case/Package: 0402; Supplier-1: Digikey
C321 = CAP_47pF-10V-10%-0402: 47pF ±10% 10V Ceramic Capacitor C0G, NP0 0402 (1005 Metric) /; Manufacturer: KEMET; Manufacturer Part Number: C0402C470K8GAC7867; Case/Package: 0402; Supplier-1: Supplier-1
C328 C342 C344-C346 = CAP_100nF-10V-10%-0402: as C301 on sheet [17] Voltage_Regulators; Case/Package: 0402; Supplier-1: Digikey
C329-C336 C339 = CAP_1uF-10V-10%-0402: 1µF ±10% 10V Ceramic Capacitor X6S 0402 (1005 Metric) /; Manufacturer: Murata Electronics; Manufacturer Part Number: GRT155C81A105KE01D; Case/Package: 0402; Supplier-1: Digikey
C340 = CAP_1uF-16V-10%-0402: 1µF ±10% 16V Ceramic Capacitor X5R 0402 (1005 Metric) /; Manufacturer: Knowles Novacap; Manufacturer Part Number: 0402BW105K160YT; Case/Package: 0402; Supplier-1: Digikey
C341 C343 = CAP_22pF-10V-10%-0402: 22pF ±10% 10V Ceramic Capacitor C0G, NP0 0402 (1005 Metric) /; Manufacturer: KEMET; Manufacturer Part Number: C0402C220K8GACTU; Case/Package: 0402; Supplier-1: Digikey
C347 = CAP_10uF-10V-20%-0402: as C300 on sheet [17] Voltage_Regulators; Case/Package: 0402; Supplier-1: Digikey
D5 = DIO-S-A_30V-200mA-SOT-323: Diode Array 1 Pair Common Cathode Schottky 30V 200mA (DC) Surface Mount SC-70, SOT-323; Manufacturer: ON Semiconductor; Manufacturer Part Number: BAT54CWT1G; Case/Package: SOT323; Supplier-1: Digikey
D6 = DIO_75V-200mA-SOD-523F: Diode Standard 100V 300mA (DC) Surface Mount SOD-123; Manufacturer: FAIRCHILD; Manufacturer Part Number: 1N4148WT; Case/Package: SOD123; Supplier-1: SIRICOM
D7 = DIO-T_10V-39V-0402: 39V Varistor 1 Circuit Surface Mount, MLCV 0402 (1005 Metric); Manufacturer: TDK Corporation; Manufacturer Part Number: AVRL101A1R1NTB; Supplier-1: Digikey; Case/Package: 0402
L8-L11 = IND_1uH-3.8A-20%-1008: as L4 on sheet [17] Voltage_Regulators; Manufacturer Part Number: DFE252010P-1R0M=P2; Case/Package: 1008; Supplier-1: Digikey
Q5 = MOSFET-N_20V-2.9A-SOT-23: N Channel 20V 2.9A 1V @ 250uA 47mΩ @ 3.6A,4.5V 700mW SOT-23(SOT-23-3) MOSFET RoHS /; Manufacturer: WILLSEMI(Will Semicon); Manufacturer Part Number: WNM2016-3/TR; Case/Package: SOT-23(SOT-23-3); Supplier-1: LCSC
Q6 = MOSFET-N_20V-820mA-SOT-323: N Channel 20V 820mA 850mV @ 250uA 310mΩ @ 550mA,4.5V 310mW SOT-323(SC-70) MOSFET RoHS /; Manufacturer: WILLSEMI(Will Semicon); Manufacturer Part Number: WNM2021-3/TR; Case/Package: SOT-323(SC-70); Supplier-1: LCSC
R121 = RES_200K-0.1W-1%-0402: as R114 on sheet [17] Voltage_Regulators; Case/Package: 0402; Supplier-1: Digikey
R122 = RES_51K-0.1W-1%-0402: 51 kOhms ±1% 0.1W, 1/10W Chip Resistor 0402 (1005 Metric) Automotive AEC-Q200 Thick Film /; Manufacturer: Panasonic Electronic Components; Manufacturer Part Number: ERJ-2RKF5102X; Case/Package: 0402; Supplier-1: Digikey
R123 = RES_0.1R-0.1W-1%-0402: 100 mOhms ±1% 0.1W, 1/10W Chip Resistor 0402 (1005 Metric) Current Sense, Moisture Resistant Thick Film /; Manufacturer: Samsung Electro-Mechanics; Manufacturer Part Number: RUT1005FR100CS; Casse/Package: 0402; Supplier-1: Digikey
R124-R126 = RES_10K-0.1W-1%-0402: as R105 on sheet [17] Voltage_Regulators; Case/Package: 0402; Supplier-1: Digikey
R127 R128 = RES_100R-0.1W-1%-0402: as R107 on sheet [17] Voltage_Regulators; Case/Package: 0402; Supplier-1: Digikey
R129 R131 = RES_300K-0.1W-1%-0402: 300 kOhms ±1% 0.1W, 1/10W Chip Resistor 0402 (1005 Metric) Automotive AEC-Q200 Thick Film /; Manufacturer: Panasonic Electronic Components; Manufacturer Part Number: ERJ-2RKF3003X; Case/Package: 0402; Supplier-1: Digikey
R130 = RES_100K-0.1W-1%-0402: as R110-R112 on sheet [17] Voltage_Regulators; Case/Package: 0402; Supplier-1: Digikey
U19 = IC_RK808-D-QFN68: The RK808 is a complete power supply solution for Portable systems.; Manufacturer: Rockchip; Manufacturer Part Number: RK808-D; Case/Package: QFN68; Supplier-1: Rockchip
Y4 = XTAL_32.768Khz-22pF-SMD: 32.768kHz ±20ppm Crystal 12pF 80 kOhms 2-SMD, No Lead /; Manufacturer: Ecliptek; Manufacturer Part Number: ECS-.327-6-34RR-TR; Case/Package: 0603; Supplier-1: Digikey

## Sheet [19] RAM Memory module.SchDoc: RAM Memory
size B; DocumentNumber: I; Revision: 01; SheetNumber: 19; SheetTotal: 19
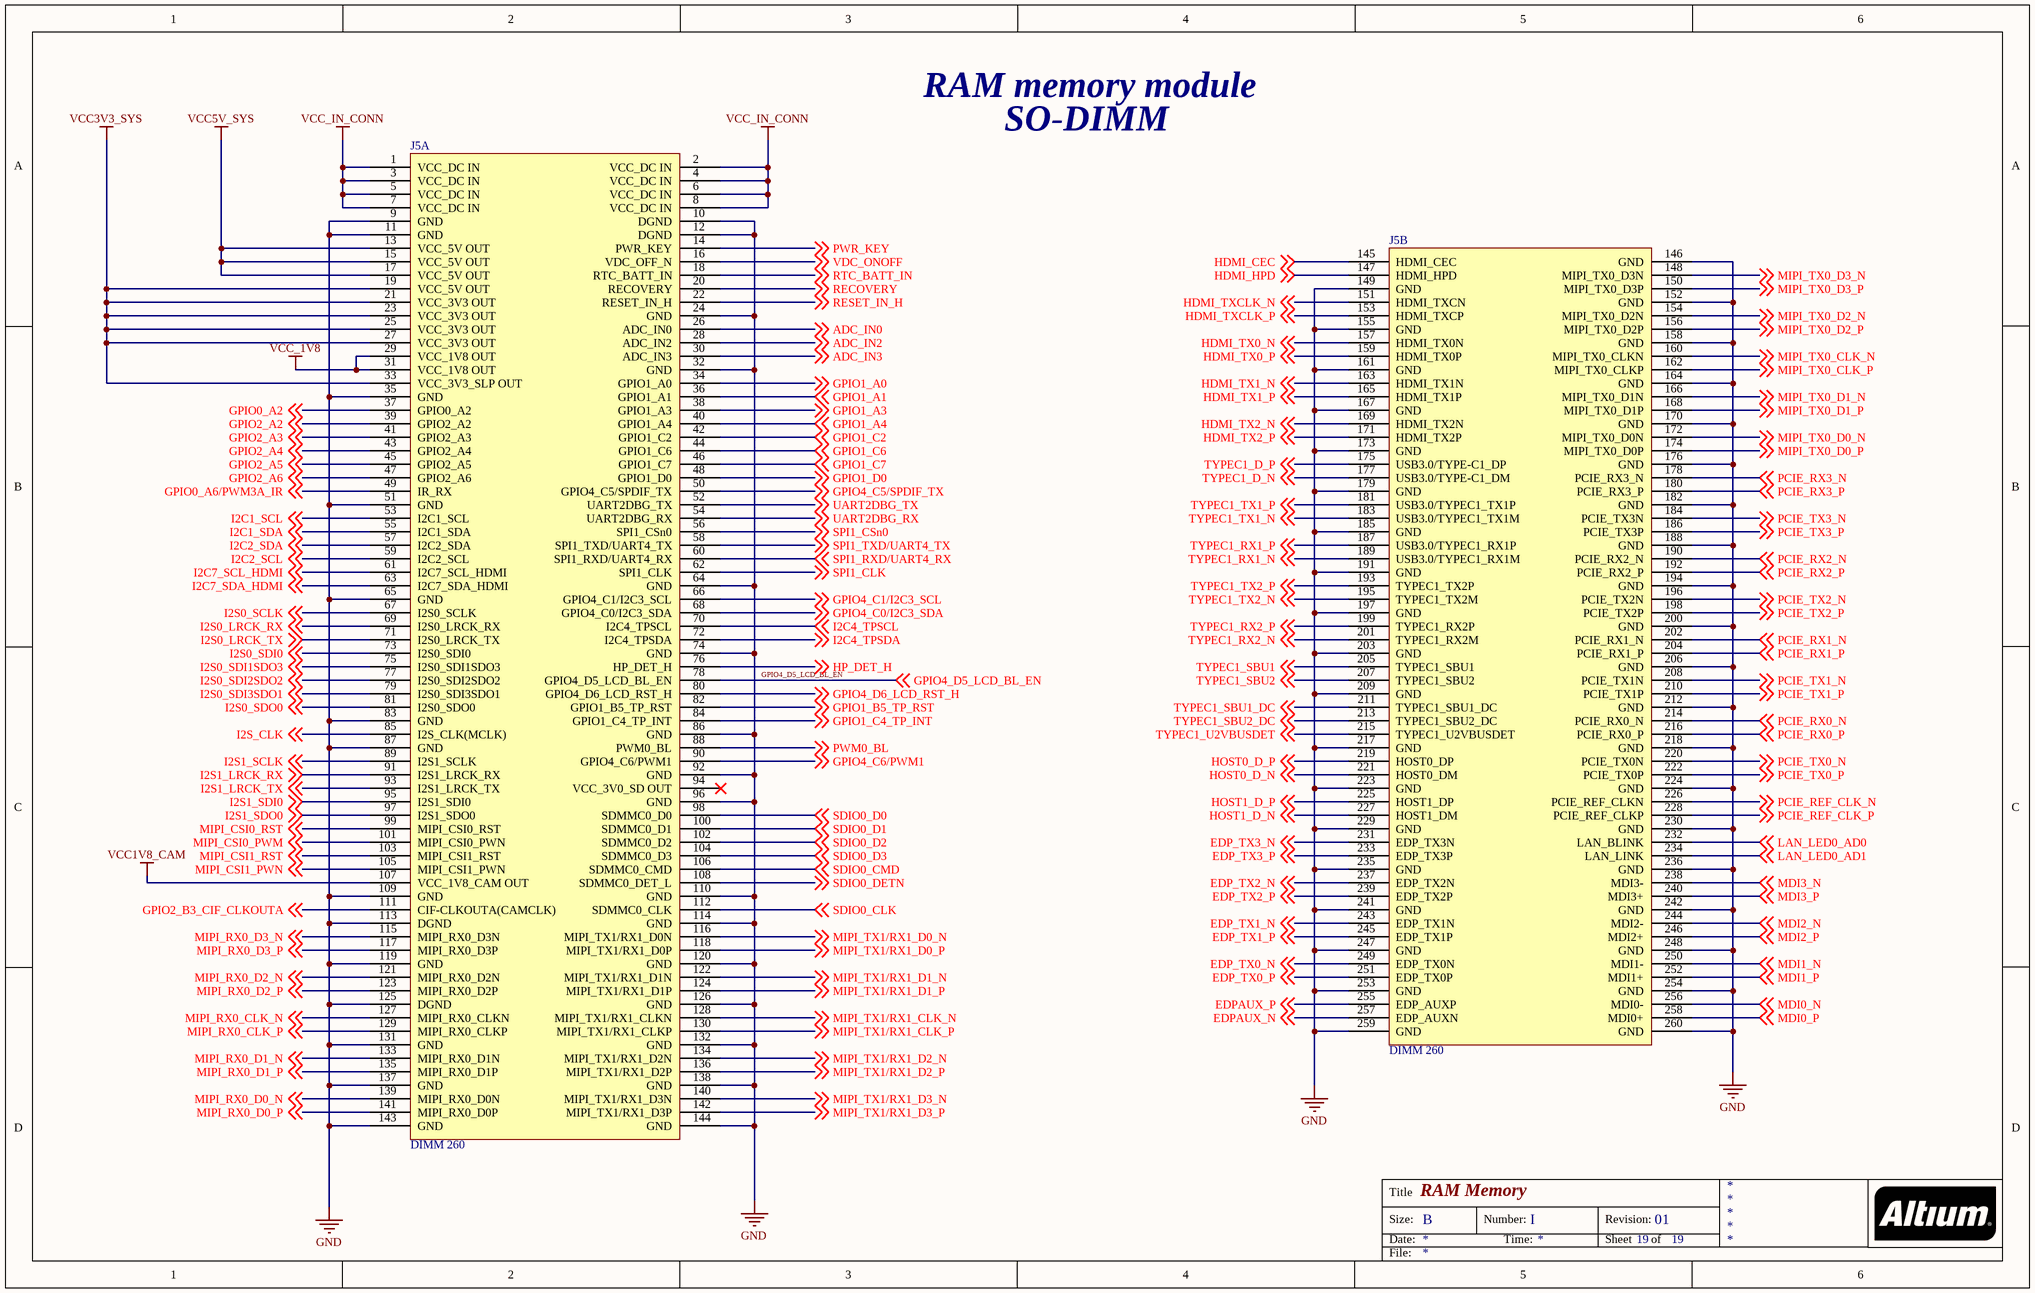
[diagram p18: [19] RAM Memory module.SchDoc]

### Parts
J5  DIMM 260  [DIMM260_DDR4]  (parts A,B of 2)

### Nets
GND: J5.9(GND) J5.10(DGND) J5.11(GND) J5.12(DGND) J5.24(GND) J5.32(GND) J5.35(GND) J5.51(GND) J5.64(GND) J5.65(GND) J5.74(GND) J5.83(GND) J5.86(GND) J5.87(GND) J5.92(GND) J5.96(GND) J5.109(GND) J5.110(GND) J5.113(DGND) J5.114(GND) J5.119(GND) J5.120(GND) J5.125(DGND) J5.126(GND) J5.131(GND) J5.132(GND) J5.137(GND) J5.138(GND) J5.143(GND) J5.144(GND) J5.146(GND) J5.149(GND) J5.152(GND) J5.155(GND) J5.158(GND) J5.161(GND) J5.164(GND) J5.167(GND) J5.170(GND) J5.173(GND) J5.176(GND) J5.179(GND) J5.182(GND) J5.185(GND) J5.188(GND) J5.191(GND) J5.194(GND) J5.197(GND) J5.200(GND) J5.203(GND) J5.206(GND) J5.209(GND) J5.212(GND) J5.217(GND) J5.218(GND) J5.223(GND) J5.224(GND) J5.229(GND) J5.230(GND) J5.235(GND) J5.236(GND) J5.241(GND) J5.242(GND) J5.247(GND) J5.248(GND) J5.253(GND) J5.254(GND) J5.259(GND) J5.260(GND)
VCC1V8_CAM: J5.107(VCC_1V8_CAM_OUT)  [project net VLDO1]
VCC3V3_SYS: J5.19(VCC_5V_OUT) J5.21(VCC_3V3_OUT) J5.23(VCC_3V3_OUT) J5.25(VCC_3V3_OUT) J5.27(VCC_3V3_OUT) J5.33(VCC_3V3_SLP_OUT)  [project net VCC7]
VCC5V_SYS: J5.13(VCC_5V_OUT) J5.15(VCC_5V_OUT) J5.17(VCC_5V_OUT)
VCC_1V8: J5.29(VCC_1V8_OUT) J5.31(VCC_1V8_OUT)  [project net EDP_AVDD_1V8]
VCC_IN_CONN: J5.1(VCC_DC_IN) J5.2(VCC_DC_IN) J5.3(VCC_DC_IN) J5.4(VCC_DC_IN) J5.5(VCC_DC_IN) J5.6(VCC_DC_IN) J5.7(VCC_DC_IN) J5.8(VCC_DC_IN)
ADC_IN0: J5.26(ADC_IN0) ; off-sheet ADC_IN0
ADC_IN2: J5.28(ADC_IN2) ; off-sheet ADC_IN2
ADC_IN3: J5.30(ADC_IN3) ; off-sheet ADC_IN3
EDP_TX0_N: J5.249(EDP_TX0N) ; off-sheet EDP_TX0_N
EDP_TX0_P: J5.251(EDP_TX0P) ; off-sheet EDP_TX0_P
EDP_TX1_N: J5.243(EDP_TX1N) ; off-sheet EDP_TX1_N
EDP_TX1_P: J5.245(EDP_TX1P) ; off-sheet EDP_TX1_P
EDP_TX2_N: J5.237(EDP_TX2N) ; off-sheet EDP_TX2_N
EDP_TX2_P: J5.239(EDP_TX2P) ; off-sheet EDP_TX2_P
EDP_TX3_N: J5.231(EDP_TX3N) ; off-sheet EDP_TX3_N
EDP_TX3_P: J5.233(EDP_TX3P) ; off-sheet EDP_TX3_P
EDPAUX_N: J5.257(EDP_AUXN) ; off-sheet EDPAUX_N
EDPAUX_P: J5.255(EDP_AUXP) ; off-sheet EDPAUX_P
GPIO0_A2: J5.37(GPIO0_A2) ; off-sheet GPIO0_A2
GPIO0_A6/PWM3A_IR: J5.49(IR_RX) ; off-sheet GPIO0_A6/PWM3A_IR
GPIO1_A0: J5.34(GPIO1_A0) ; off-sheet GPIO1_A0
GPIO1_A1: J5.36(GPIO1_A1) ; off-sheet GPIO1_A1
GPIO1_A3: J5.38(GPIO1_A3) ; off-sheet GPIO1_A3
GPIO1_A4: J5.40(GPIO1_A4) ; off-sheet GPIO1_A4
GPIO1_B5_TP_RST: J5.82(GPIO1_B5_TP_RST) ; off-sheet GPIO1_B5_TP_RST
GPIO1_C2: J5.42(GPIO1_C2) ; off-sheet GPIO1_C2
GPIO1_C4_TP_INT: J5.84(GPIO1_C4_TP_INT) ; off-sheet GPIO1_C4_TP_INT
GPIO1_C6: J5.44(GPIO1_C6) ; off-sheet GPIO1_C6
GPIO1_C7: J5.46(GPIO1_C7) ; off-sheet GPIO1_C7
GPIO1_D0: J5.48(GPIO1_D0) ; off-sheet GPIO1_D0
GPIO2_A2: J5.39(GPIO2_A2) ; off-sheet GPIO2_A2
GPIO2_A3: J5.41(GPIO2_A3) ; off-sheet GPIO2_A3
GPIO2_A4: J5.43(GPIO2_A4) ; off-sheet GPIO2_A4
GPIO2_A5: J5.45(GPIO2_A5) ; off-sheet GPIO2_A5
GPIO2_A6: J5.47(GPIO2_A6) ; off-sheet GPIO2_A6
GPIO2_B3_CIF_CLKOUTA: J5.111(CIF-CLKOUTA(CAMCLK)) ; off-sheet GPIO2_B3_CIF_CLKOUTA
GPIO4_C0/I2C3_SDA: J5.68(GPIO4_C0/I2C3_SDA) ; off-sheet GPIO4_C0/I2C3_SDA
GPIO4_C1/I2C3_SCL: J5.66(GPIO4_C1/I2C3_SCL) ; off-sheet GPIO4_C1/I2C3_SCL
GPIO4_C5/SPDIF_TX: J5.50(GPIO4_C5/SPDIF_TX) ; off-sheet GPIO4_C5/SPDIF_TX
GPIO4_C6/PWM1: J5.90(GPIO4_C6/PWM1) ; off-sheet GPIO4_C6/PWM1
GPIO4_D5_LCD_BL_EN: J5.78(GPIO4_D5_LCD_BL_EN) ; off-sheet GPIO4_D5_LCD_BL_EN
GPIO4_D6_LCD_RST_H: J5.80(GPIO4_D6_LCD_RST_H) ; off-sheet GPIO4_D6_LCD_RST_H
HDMI_CEC: J5.145(HDMI_CEC) ; off-sheet HDMI_CEC
HDMI_HPD: J5.147(HDMI_HPD) ; off-sheet HDMI_HPD
HDMI_TX0_N: J5.157(HDMI_TX0N) ; off-sheet HDMI_TX0_N
HDMI_TX0_P: J5.159(HDMI_TX0P) ; off-sheet HDMI_TX0_P
HDMI_TX1_N: J5.163(HDMI_TX1N) ; off-sheet HDMI_TX1_N
HDMI_TX1_P: J5.165(HDMI_TX1P) ; off-sheet HDMI_TX1_P
HDMI_TX2_N: J5.169(HDMI_TX2N) ; off-sheet HDMI_TX2_N
HDMI_TX2_P: J5.171(HDMI_TX2P) ; off-sheet HDMI_TX2_P
HDMI_TXCLK_N: J5.151(HDMI_TXCN) ; off-sheet HDMI_TXCLK_N
HDMI_TXCLK_P: J5.153(HDMI_TXCP) ; off-sheet HDMI_TXCLK_P
HOST0_D_N: J5.221(HOST0_DM) ; off-sheet HOST0_D_N
HOST0_D_P: J5.219(HOST0_DP) ; off-sheet HOST0_D_P
HOST1_D_N: J5.227(HOST1_DM) ; off-sheet HOST1_D_N
HOST1_D_P: J5.225(HOST1_DP) ; off-sheet HOST1_D_P
HP_DET_H: J5.76(HP_DET_H) ; off-sheet HP_DET_H
I2C1_SCL: J5.53(I2C1_SCL) ; off-sheet I2C1_SCL
I2C1_SDA: J5.55(I2C1_SDA) ; off-sheet I2C1_SDA
I2C2_SCL: J5.59(I2C2_SCL) ; off-sheet I2C2_SCL
I2C2_SDA: J5.57(I2C2_SDA) ; off-sheet I2C2_SDA
I2C4_TPSCL: J5.70(I2C4_TPSCL) ; off-sheet I2C4_TPSCL
I2C4_TPSDA: J5.72(I2C4_TPSDA) ; off-sheet I2C4_TPSDA
I2C7_SCL_HDMI: J5.61(I2C7_SCL_HDMI) ; off-sheet I2C7_SCL_HDMI
I2C7_SDA_HDMI: J5.63(I2C7_SDA_HDMI) ; off-sheet I2C7_SDA_HDMI
I2S0_LRCK_RX: J5.69(I2S0_LRCK_RX) ; off-sheet I2S0_LRCK_RX
I2S0_LRCK_TX: J5.71(I2S0_LRCK_TX) ; off-sheet I2S0_LRCK_TX
I2S0_SCLK: J5.67(I2S0_SCLK) ; off-sheet I2S0_SCLK
I2S0_SDI0: J5.73(I2S0_SDI0) ; off-sheet I2S0_SDI0
I2S0_SDI1SDO3: J5.75(I2S0_SDI1SDO3) ; off-sheet I2S0_SDI1SDO3
I2S0_SDI2SDO2: J5.77(I2S0_SDI2SDO2) ; off-sheet I2S0_SDI2SDO2
I2S0_SDI3SDO1: J5.79(I2S0_SDI3SDO1) ; off-sheet I2S0_SDI3SDO1
I2S0_SDO0: J5.81(I2S0_SDO0) ; off-sheet I2S0_SDO0
I2S1_LRCK_RX: J5.91(I2S1_LRCK_RX) ; off-sheet I2S1_LRCK_RX
I2S1_LRCK_TX: J5.93(I2S1_LRCK_TX) ; off-sheet I2S1_LRCK_TX
I2S1_SCLK: J5.89(I2S1_SCLK) ; off-sheet I2S1_SCLK
I2S1_SDI0: J5.95(I2S1_SDI0) ; off-sheet I2S1_SDI0
I2S1_SDO0: J5.97(I2S1_SDO0) ; off-sheet I2S1_SDO0
I2S_CLK: J5.85(I2S_CLK(MCLK)) ; off-sheet I2S_CLK
LAN_LED0_AD0: J5.232(LAN_BLINK) ; off-sheet LAN_LED0_AD0
LAN_LED0_AD1: J5.234(LAN_LINK) ; off-sheet LAN_LED0_AD1
MDI0_N: J5.256(MDI0-) ; off-sheet MDI0_N
MDI0_P: J5.258(MDI0+) ; off-sheet MDI0_P
MDI1_N: J5.250(MDI1-) ; off-sheet MDI1_N
MDI1_P: J5.252(MDI1+) ; off-sheet MDI1_P
MDI2_N: J5.244(MDI2-) ; off-sheet MDI2_N
MDI2_P: J5.246(MDI2+) ; off-sheet MDI2_P
MDI3_N: J5.238(MDI3-) ; off-sheet MDI3_N
MDI3_P: J5.240(MDI3+) ; off-sheet MDI3_P
MIPI_CSI0_PWM: J5.101(MIPI_CSI0_PWN) ; off-sheet MIPI_CSI0_PWM
MIPI_CSI0_RST: J5.99(MIPI_CSI0_RST) ; off-sheet MIPI_CSI0_RST
MIPI_CSI1_PWN: J5.105(MIPI_CSI1_PWN) ; off-sheet MIPI_CSI1_PWN
MIPI_CSI1_RST: J5.103(MIPI_CSI1_RST) ; off-sheet MIPI_CSI1_RST
MIPI_RX0_CLK_N: J5.127(MIPI_RX0_CLKN) ; off-sheet MIPI_RX0_CLK_N
MIPI_RX0_CLK_P: J5.129(MIPI_RX0_CLKP) ; off-sheet MIPI_RX0_CLK_P
MIPI_RX0_D0_N: J5.139(MIPI_RX0_D0N) ; off-sheet MIPI_RX0_D0_N
MIPI_RX0_D0_P: J5.141(MIPI_RX0_D0P) ; off-sheet MIPI_RX0_D0_P
MIPI_RX0_D1_N: J5.133(MIPI_RX0_D1N) ; off-sheet MIPI_RX0_D1_N
MIPI_RX0_D1_P: J5.135(MIPI_RX0_D1P) ; off-sheet MIPI_RX0_D1_P
MIPI_RX0_D2_N: J5.121(MIPI_RX0_D2N) ; off-sheet MIPI_RX0_D2_N
MIPI_RX0_D2_P: J5.123(MIPI_RX0_D2P) ; off-sheet MIPI_RX0_D2_P
MIPI_RX0_D3_N: J5.115(MIPI_RX0_D3N) ; off-sheet MIPI_RX0_D3_N
MIPI_RX0_D3_P: J5.117(MIPI_RX0_D3P) ; off-sheet MIPI_RX0_D3_P
MIPI_TX0_CLK_N: J5.160(MIPI_TX0_CLKN) ; off-sheet MIPI_TX0_CLK_N
MIPI_TX0_CLK_P: J5.162(MIPI_TX0_CLKP) ; off-sheet MIPI_TX0_CLK_P
MIPI_TX0_D0_N: J5.172(MIPI_TX0_D0N) ; off-sheet MIPI_TX0_D0_N
MIPI_TX0_D0_P: J5.174(MIPI_TX0_D0P) ; off-sheet MIPI_TX0_D0_P
MIPI_TX0_D1_N: J5.166(MIPI_TX0_D1N) ; off-sheet MIPI_TX0_D1_N
MIPI_TX0_D1_P: J5.168(MIPI_TX0_D1P) ; off-sheet MIPI_TX0_D1_P
MIPI_TX0_D2_N: J5.154(MIPI_TX0_D2N) ; off-sheet MIPI_TX0_D2_N
MIPI_TX0_D2_P: J5.156(MIPI_TX0_D2P) ; off-sheet MIPI_TX0_D2_P
MIPI_TX0_D3_N: J5.148(MIPI_TX0_D3N) ; off-sheet MIPI_TX0_D3_N
MIPI_TX0_D3_P: J5.150(MIPI_TX0_D3P) ; off-sheet MIPI_TX0_D3_P
MIPI_TX1/RX1_CLK_N: J5.128(MIPI_TX1/RX1_CLKN) ; off-sheet MIPI_TX1/RX1_CLK_N
MIPI_TX1/RX1_CLK_P: J5.130(MIPI_TX1/RX1_CLKP) ; off-sheet MIPI_TX1/RX1_CLK_P
MIPI_TX1/RX1_D0_N: J5.116(MIPI_TX1/RX1_D0N) ; off-sheet MIPI_TX1/RX1_D0_N
MIPI_TX1/RX1_D0_P: J5.118(MIPI_TX1/RX1_D0P) ; off-sheet MIPI_TX1/RX1_D0_P
MIPI_TX1/RX1_D1_N: J5.122(MIPI_TX1/RX1_D1N) ; off-sheet MIPI_TX1/RX1_D1_N
MIPI_TX1/RX1_D1_P: J5.124(MIPI_TX1/RX1_D1P) ; off-sheet MIPI_TX1/RX1_D1_P
MIPI_TX1/RX1_D2_N: J5.134(MIPI_TX1/RX1_D2N) ; off-sheet MIPI_TX1/RX1_D2_N
MIPI_TX1/RX1_D2_P: J5.136(MIPI_TX1/RX1_D2P) ; off-sheet MIPI_TX1/RX1_D2_P
MIPI_TX1/RX1_D3_N: J5.140(MIPI_TX1/RX1_D3N) ; off-sheet MIPI_TX1/RX1_D3_N
MIPI_TX1/RX1_D3_P: J5.142(MIPI_TX1/RX1_D3P) ; off-sheet MIPI_TX1/RX1_D3_P
PCIE_REF_CLK_N: J5.226(PCIE_REF_CLKN) ; off-sheet PCIE_REF_CLK_N
PCIE_REF_CLK_P: J5.228(PCIE_REF_CLKP) ; off-sheet PCIE_REF_CLK_P
PCIE_RX0_N: J5.214(PCIE_RX0_N) ; off-sheet PCIE_RX0_N
PCIE_RX0_P: J5.216(PCIE_RX0_P) ; off-sheet PCIE_RX0_P
PCIE_RX1_N: J5.202(PCIE_RX1_N) ; off-sheet PCIE_RX1_N
PCIE_RX1_P: J5.204(PCIE_RX1_P) ; off-sheet PCIE_RX1_P
PCIE_RX2_N: J5.190(PCIE_RX2_N) ; off-sheet PCIE_RX2_N
PCIE_RX2_P: J5.192(PCIE_RX2_P) ; off-sheet PCIE_RX2_P
PCIE_RX3_N: J5.178(PCIE_RX3_N) ; off-sheet PCIE_RX3_N
PCIE_RX3_P: J5.180(PCIE_RX3_P) ; off-sheet PCIE_RX3_P
PCIE_TX0_N: J5.220(PCIE_TX0N) ; off-sheet PCIE_TX0_N
PCIE_TX0_P: J5.222(PCIE_TX0P) ; off-sheet PCIE_TX0_P
PCIE_TX1_N: J5.208(PCIE_TX1N) ; off-sheet PCIE_TX1_N
PCIE_TX1_P: J5.210(PCIE_TX1P) ; off-sheet PCIE_TX1_P
PCIE_TX2_N: J5.196(PCIE_TX2N) ; off-sheet PCIE_TX2_N
PCIE_TX2_P: J5.198(PCIE_TX2P) ; off-sheet PCIE_TX2_P
PCIE_TX3_N: J5.184(PCIE_TX3N) ; off-sheet PCIE_TX3_N
PCIE_TX3_P: J5.186(PCIE_TX3P) ; off-sheet PCIE_TX3_P
PWM0_BL: J5.88(PWM0_BL) ; off-sheet PWM0_BL
PWR_KEY: J5.14(PWR_KEY) ; off-sheet PWR_KEY
RECOVERY: J5.20(RECOVERY) ; off-sheet RECOVERY
RESET_IN_H: J5.22(RESET_IN_H) ; off-sheet RESET_IN_H
RTC_BATT_IN: J5.18(RTC_BATT_IN) ; off-sheet RTC_BATT_IN
SDIO0_CLK: J5.112(SDMMC0_CLK) ; off-sheet SDIO0_CLK
SDIO0_CMD: J5.106(SDMMC0_CMD) ; off-sheet SDIO0_CMD
SDIO0_D0: J5.98(SDMMC0_D0) ; off-sheet SDIO0_D0
SDIO0_D1: J5.100(SDMMC0_D1) ; off-sheet SDIO0_D1
SDIO0_D2: J5.102(SDMMC0_D2) ; off-sheet SDIO0_D2
SDIO0_D3: J5.104(SDMMC0_D3) ; off-sheet SDIO0_D3
SDIO0_DETN: J5.108(SDMMC0_DET_L) ; off-sheet SDIO0_DETN
SPI1_CLK: J5.62(SPI1_CLK) ; off-sheet SPI1_CLK
SPI1_CSn0: J5.56(SPI1_CSn0) ; off-sheet SPI1_CSn0
SPI1_RXD/UART4_RX: J5.60(SPI1_RXD/UART4_RX) ; off-sheet SPI1_RXD/UART4_RX
SPI1_TXD/UART4_TX: J5.58(SPI1_TXD/UART4_TX) ; off-sheet SPI1_TXD/UART4_TX
TYPEC1_D_N: J5.177(USB3.0/TYPE-C1_DM) ; off-sheet TYPEC1_D_N
TYPEC1_D_P: J5.175(USB3.0/TYPE-C1_DP) ; off-sheet TYPEC1_D_P
TYPEC1_RX1_N: J5.189(USB3.0/TYPEC1_RX1M) ; off-sheet TYPEC1_RX1_N
TYPEC1_RX1_P: J5.187(USB3.0/TYPEC1_RX1P) ; off-sheet TYPEC1_RX1_P
TYPEC1_RX2_N: J5.201(TYPEC1_RX2M) ; off-sheet TYPEC1_RX2_N
TYPEC1_RX2_P: J5.199(TYPEC1_RX2P) ; off-sheet TYPEC1_RX2_P
TYPEC1_SBU1: J5.205(TYPEC1_SBU1) ; off-sheet TYPEC1_SBU1
TYPEC1_SBU1_DC: J5.211(TYPEC1_SBU1_DC) ; off-sheet TYPEC1_SBU1_DC
TYPEC1_SBU2: J5.207(TYPEC1_SBU2) ; off-sheet TYPEC1_SBU2
TYPEC1_SBU2_DC: J5.213(TYPEC1_SBU2_DC) ; off-sheet TYPEC1_SBU2_DC
TYPEC1_TX1_N: J5.183(USB3.0/TYPEC1_TX1M) ; off-sheet TYPEC1_TX1_N
TYPEC1_TX1_P: J5.181(USB3.0/TYPEC1_TX1P) ; off-sheet TYPEC1_TX1_P
TYPEC1_TX2_N: J5.195(TYPEC1_TX2M) ; off-sheet TYPEC1_TX2_N
TYPEC1_TX2_P: J5.193(TYPEC1_TX2P) ; off-sheet TYPEC1_TX2_P
TYPEC1_U2VBUSDET: J5.215(TYPEC1_U2VBUSDET) ; off-sheet TYPEC1_U2VBUSDET
UART2DBG_RX: J5.54(UART2DBG_RX) ; off-sheet UART2DBG_RX
UART2DBG_TX: J5.52(UART2DBG_TX) ; off-sheet UART2DBG_TX
VDC_ONOFF: J5.16(VDC_OFF_N) ; off-sheet VDC_ONOFF

Not connected (* = marked no-connect by the designer): J5 94(VCC_3V0_SD_OUT)*

### Notes on the sheet
- RAM memory module
- SO-DIMM
- Title
- Size:
- Date:
- B
- Number:
- Time:
- Revision:
- Sheet
- of
- File:

### Library data of the parts
J5 = CON-DIMM_260-SMD: Dimm 260 pin smd plating on pcb; Manufacturer: NA; Manufacturer Part Number: NA; Case/Package: NA; Supplier-1: NA